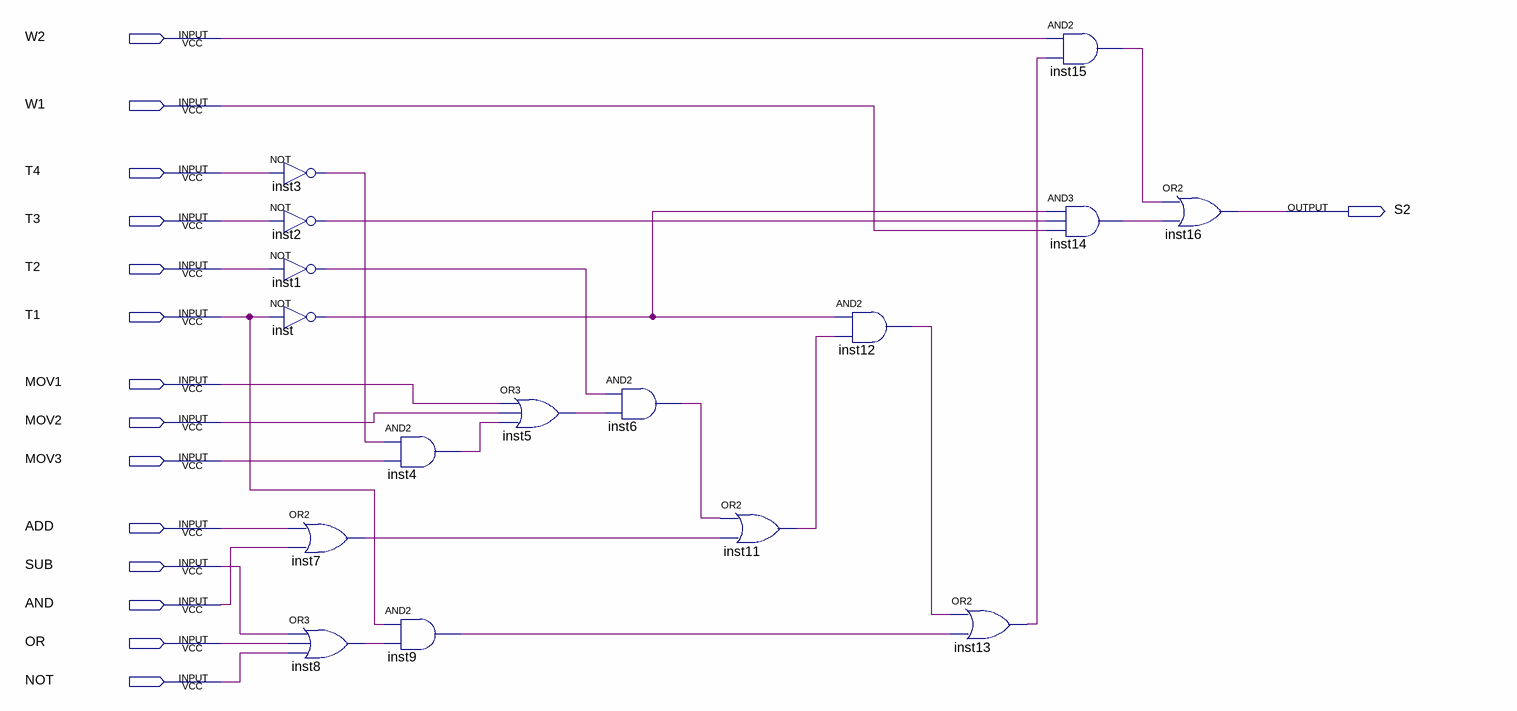
[diagram p0: schematic sheet]
// Quartus schematic S2.bdf as structural Verilog: 16 symbols, 15 pins
module S2 (
  input  W2,
  input  W1,
  input  T4,
  input  T3,
  input  T2,
  input  T1,
  input  MOV1,
  input  MOV2,
  input  MOV3,
  input  ADD,
  input  SUB,
  input  AND,
  input  OR,
  input  NOT,
  output S2
);

  wire inst1_out, inst2_out, inst3_out, inst4_out, inst5_out, inst6_out, inst7_out, inst8_out, inst9_out,
       inst11_out, inst12_out, inst13_out, inst14_out, inst15_out, inst_out;

  not inst3 (inst3_out, T4);
  not inst2 (inst2_out, T3);
  not inst1 (inst1_out, T2);
  not inst (inst_out, T1);
  or inst7 (inst7_out, ADD, AND);
  or inst8 (inst8_out, SUB, OR, NOT);
  and inst4 (inst4_out, inst3_out, MOV3);
  and inst9 (inst9_out, T1, inst8_out);
  or inst5 (inst5_out, MOV1, MOV2, inst4_out);
  and inst6 (inst6_out, inst1_out, inst5_out);
  or inst11 (inst11_out, inst6_out, inst7_out);
  and inst12 (inst12_out, inst_out, inst11_out);
  or inst13 (inst13_out, inst12_out, inst9_out);
  and inst15 (inst15_out, W2, inst13_out);
  and inst14 (inst14_out, inst_out, inst2_out, W1);
  or inst16 (S2, inst15_out, inst14_out);
endmodule
